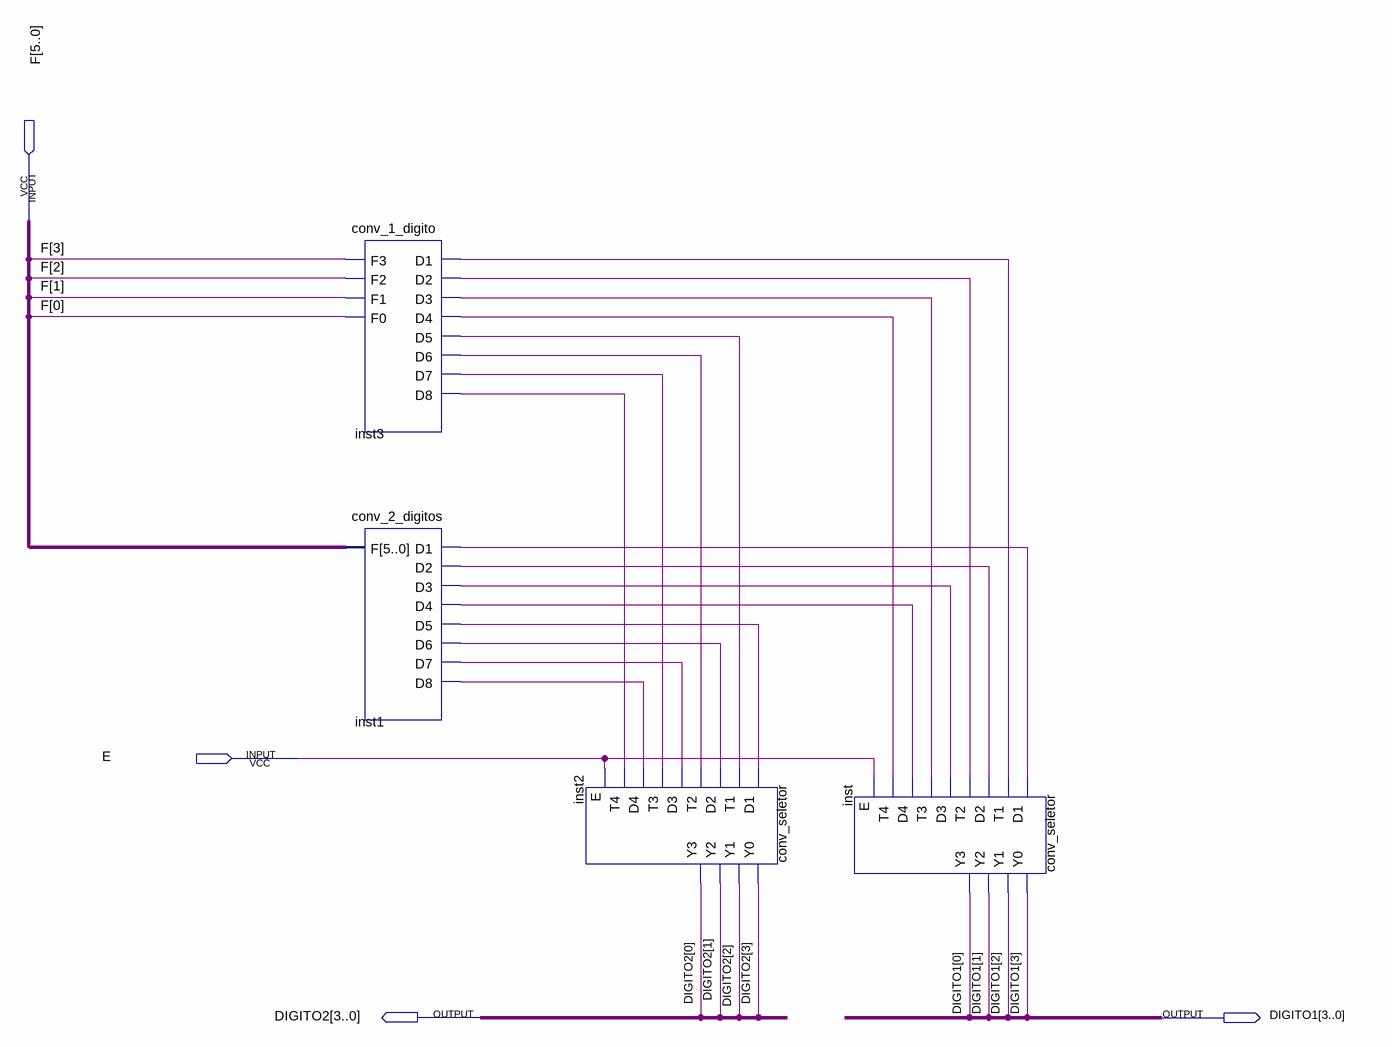
[diagram p0: schematic sheet]
// Quartus schematic conversor_completo.bdf as structural Verilog: 4 symbols, 4 pins
module conversor_completo (
  input  [5:0] F,
  input  E,
  output [3:0] DIGITO2,
  output [3:0] DIGITO1
);

  wire inst1_d1, inst1_d2, inst1_d3, inst1_d4, inst1_d5, inst1_d6, inst1_d7, inst1_d8, inst3_d1, inst3_d2,
       inst3_d3, inst3_d4, inst3_d5, inst3_d6, inst3_d7, inst3_d8;

  conv_1_digito inst3 (
    .F3(F[3]), .F2(F[2]), .F1(F[1]), .F0(F[0]), .D1(inst3_d1), .D2(inst3_d2), .D3(inst3_d3), .D4(inst3_d4),
    .D5(inst3_d5), .D6(inst3_d6), .D7(inst3_d7), .D8(inst3_d8));
  conv_2_digitos inst1 (
    .F(F), .D1(inst1_d1), .D2(inst1_d2), .D3(inst1_d3), .D4(inst1_d4), .D5(inst1_d5), .D6(inst1_d6),
    .D7(inst1_d7), .D8(inst1_d8));
  conv_seletor inst2 (
    .D1(inst1_d5), .T1(inst3_d5), .D2(inst1_d6), .T2(inst3_d6), .D3(inst1_d7), .T3(inst3_d7), .D4(inst1_d8),
    .T4(inst3_d8), .E(E), .Y0(DIGITO2[3]), .Y1(DIGITO2[2]), .Y2(DIGITO2[1]), .Y3(DIGITO2[0]));
  conv_seletor inst (
    .D1(inst1_d1), .T1(inst3_d1), .D2(inst1_d2), .T2(inst3_d2), .D3(inst1_d3), .T3(inst3_d3), .D4(inst1_d4),
    .T4(inst3_d4), .E(E), .Y0(DIGITO1[3]), .Y1(DIGITO1[2]), .Y2(DIGITO1[1]), .Y3(DIGITO1[0]));
endmodule
